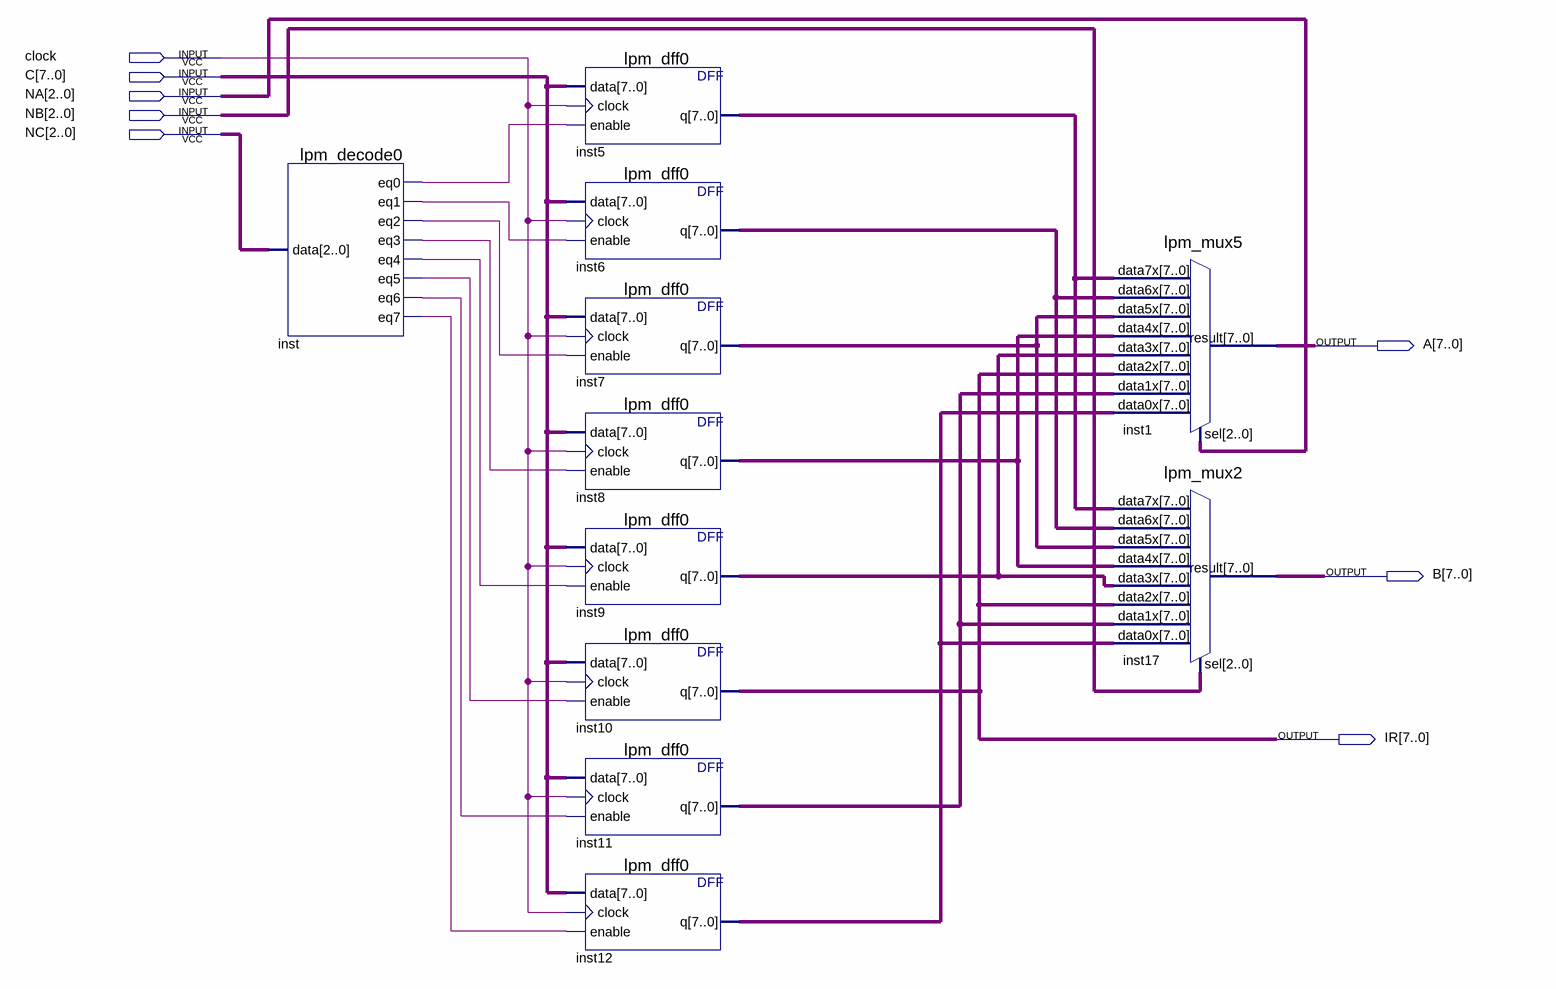
[diagram p0: schematic sheet]
// Quartus schematic BLOK_REG.bdf as structural Verilog: 11 symbols, 8 pins
module BLOK_REG (
  input  clock,
  input  [7:0] C,
  input  [2:0] NA,
  input  [2:0] NB,
  input  [2:0] NC,
  output [7:0] A,
  output [7:0] B,
  output [7:0] IR
);

  wire inst_eq0, inst_eq1, inst_eq2, inst_eq3, inst_eq4, inst_eq5, inst_eq6, inst_eq7;
  wire [7:0] inst5_q, inst6_q, inst7_q, inst8_q, inst9_q, inst11_q, inst12_q;

  lpm_decode0 inst (
    .data(NC), .eq0(inst_eq0), .eq1(inst_eq1), .eq2(inst_eq2), .eq3(inst_eq3), .eq4(inst_eq4),
    .eq5(inst_eq5), .eq6(inst_eq6), .eq7(inst_eq7));
  lpm_dff0 inst5 (.data(C), .clock(clock), .enable(inst_eq0), .q(inst5_q));
  lpm_dff0 inst6 (.data(C), .clock(clock), .enable(inst_eq1), .q(inst6_q));
  lpm_dff0 inst7 (.data(C), .clock(clock), .enable(inst_eq2), .q(inst7_q));
  lpm_dff0 inst8 (.data(C), .clock(clock), .enable(inst_eq3), .q(inst8_q));
  lpm_dff0 inst9 (.data(C), .clock(clock), .enable(inst_eq4), .q(inst9_q));
  lpm_dff0 inst10 (.data(C), .clock(clock), .enable(inst_eq5), .q(IR));
  lpm_dff0 inst11 (.data(C), .clock(clock), .enable(inst_eq6), .q(inst11_q));
  lpm_dff0 inst12 (.data(C), .clock(clock), .enable(inst_eq7), .q(inst12_q));
  lpm_mux5 inst1 (
    .data7x(inst5_q), .data6x(inst6_q), .data5x(inst7_q), .data4x(inst8_q), .data3x(inst9_q), .data2x(IR),
    .data1x(inst11_q), .data0x(inst12_q), .sel(NA), .result(A));
  lpm_mux2 inst17 (
    .data7x(inst5_q), .data6x(inst6_q), .data5x(inst7_q), .data4x(inst8_q), .data3x(inst9_q), .data2x(IR),
    .data1x(inst11_q), .data0x(inst12_q), .sel(NB), .result(B));
endmodule
